# EAGLE board SCCB1508-00 (EAGLE 7.3.0), part 1 of 2
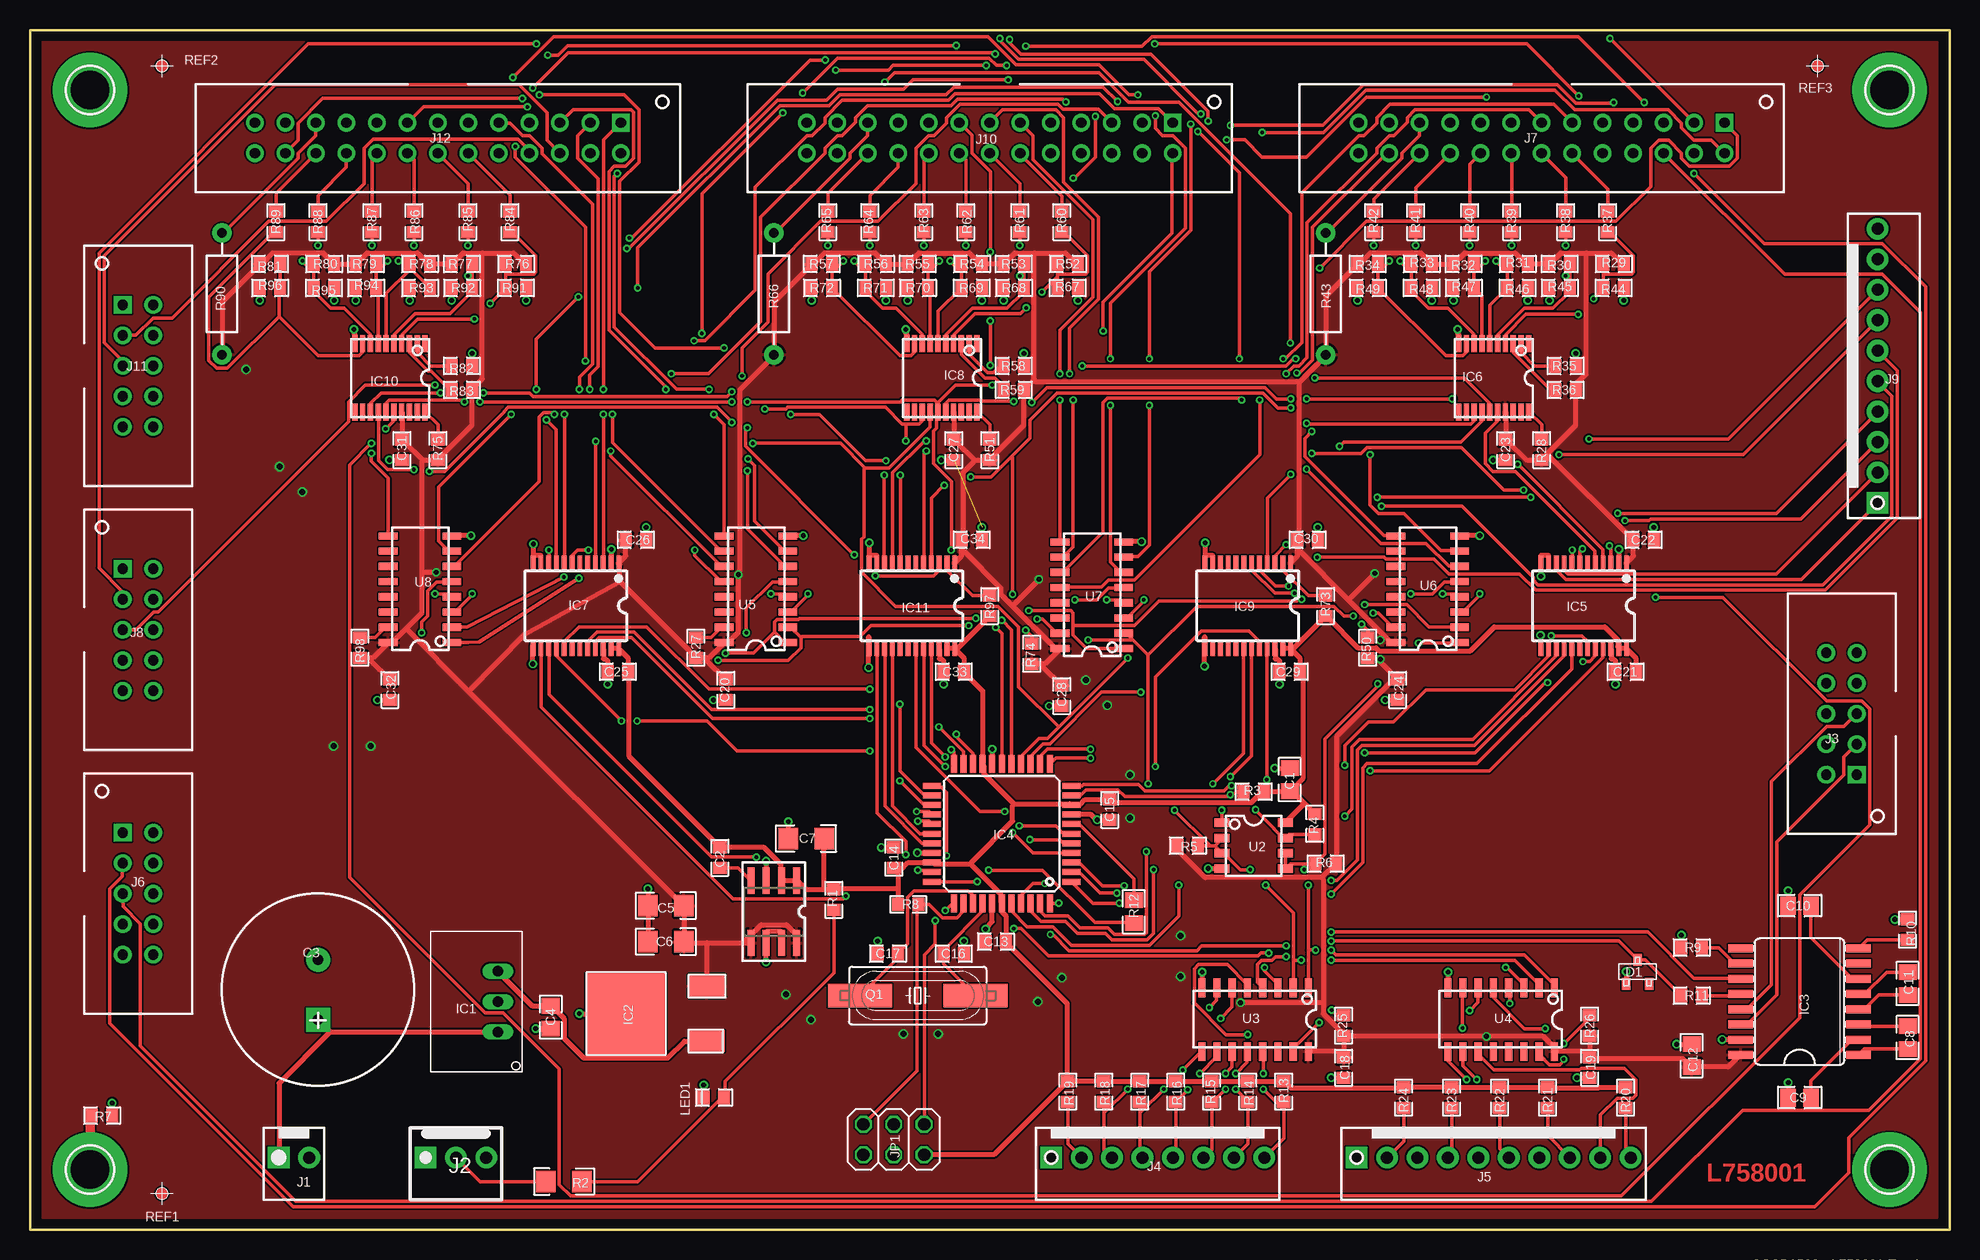
[diagram p2: board, top side]
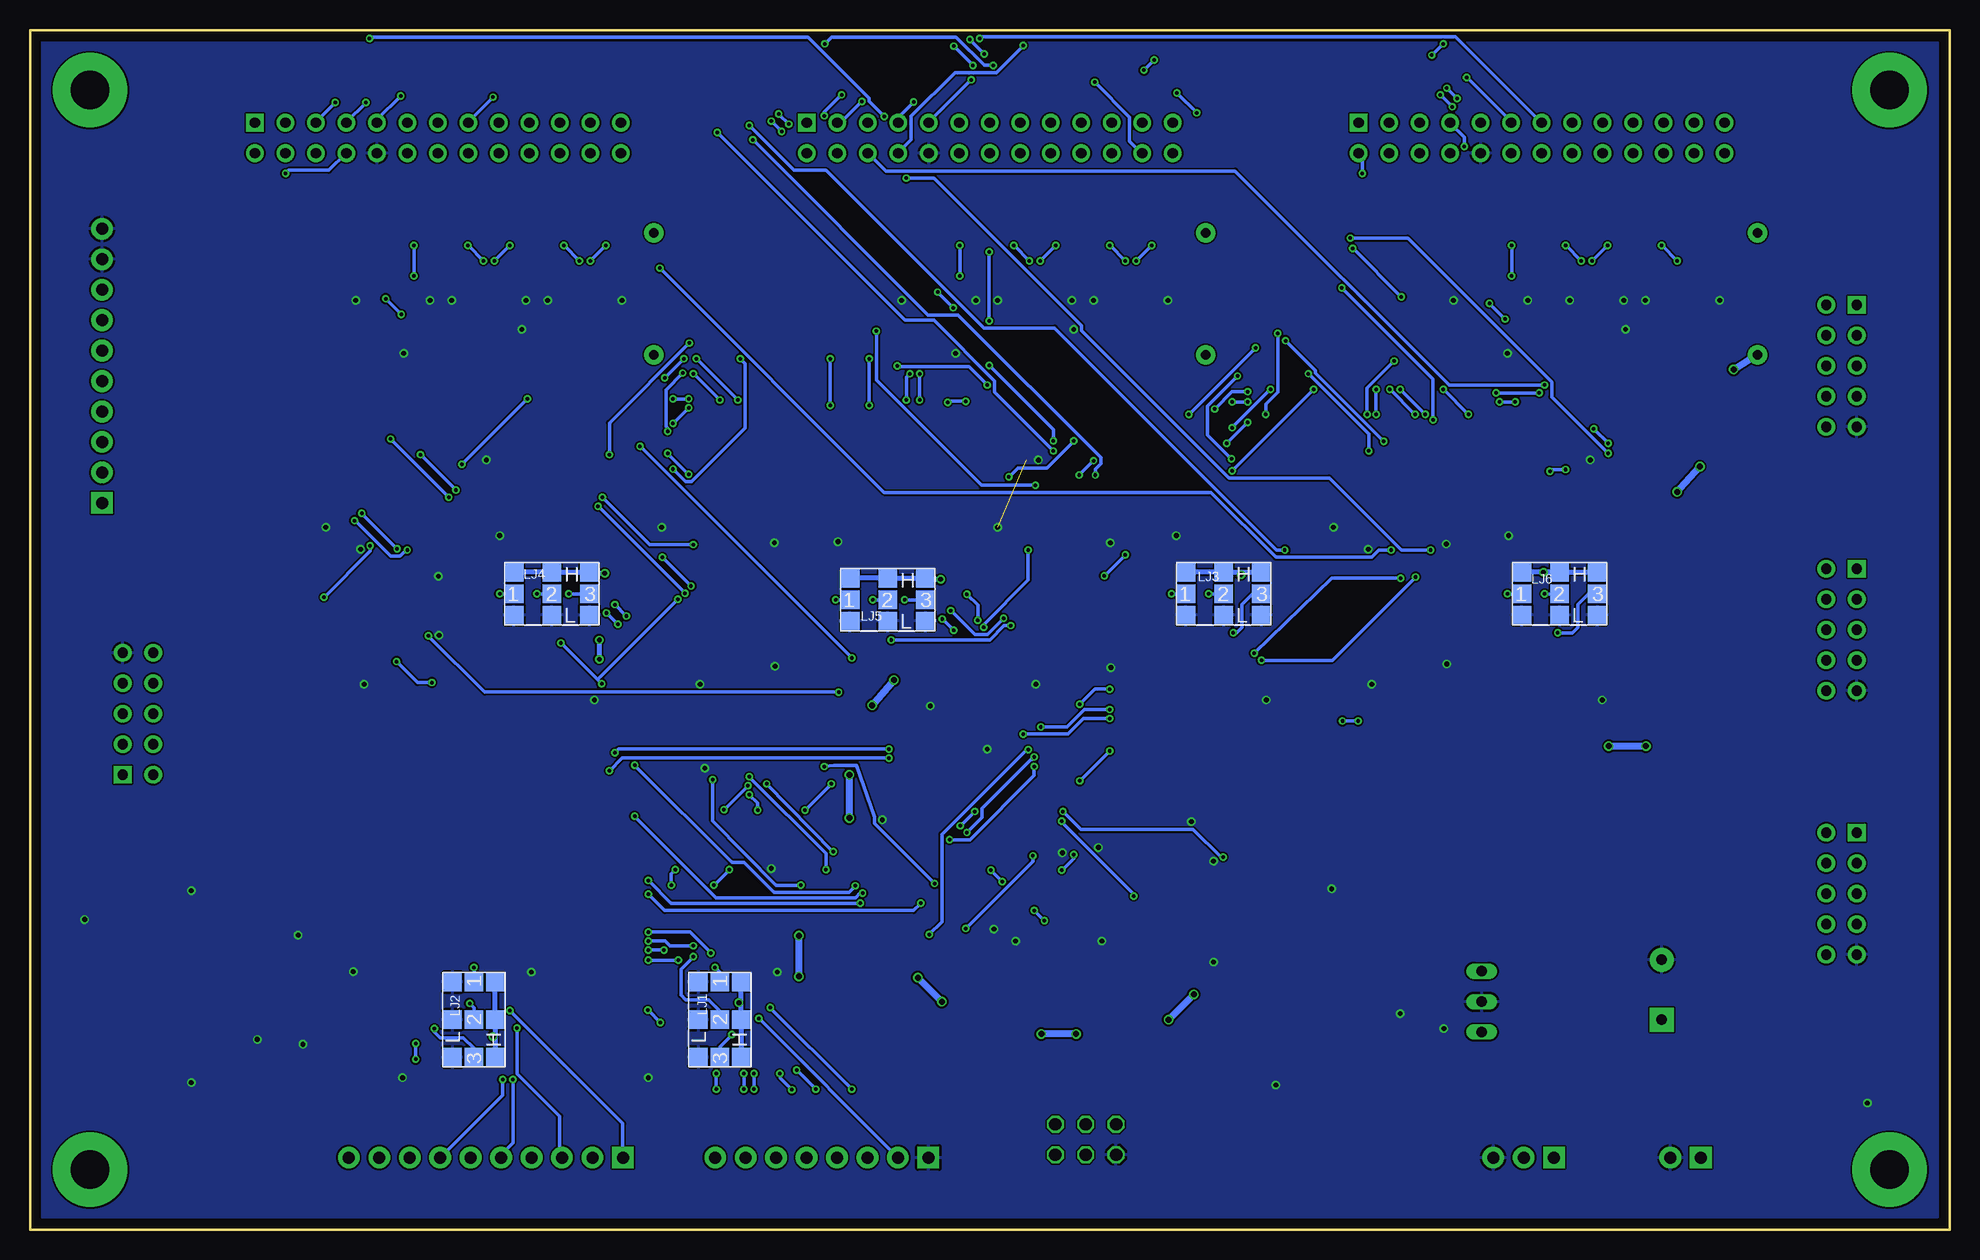
[diagram p3: board, bottom side, seen from below]

Size 160 x 100 mm. Coordinates in mm from the lower left corner, seen from the top.
Outline: 0,0 160,0 160,100 0,100 0,0
Copper layers (1*16): Top 0.035mm / dielectric 1.5mm / Bottom 0.035mm
Design rules "PCB-POOL Standard *": minimum track width 0.3mm, minimum drill 0.3mm, track to track 0.15mm, track to pad 0.15mm, pad to pad 0.15mm, via to via 0.15mm, smd to smd 0.15mm, copper to edge 0.3mm, drill to drill 0.2mm, minimum pad ring 0.2mm, minimum via ring 0.15mm, stop-mask expansion 0.075mm, vias tented up to drill 0mil, thermal gap 0.2mm
Net classes: 1 SUPPLY: width 0.4 mm, drill 0.4 mm

## Footprints (pad centres in the part's own frame; a part is rotated, then mirrored left to right if it is on the bottom)
0805 = smd 1.3 x 1.5: 1 -0.95,0; 2 0.95,0
0603 = smd 1 x 1.1: 1 -0.85,0; 2 0.85,0
C_POL_RM5_D16 = drill 0.86 pad 2 square: 1 -2.5,0 | drill 0.86 pad 2: 2 2.5,0
1206 = smd 1.6 x 1.8: 1 -1.5,0; 2 1.5,0
SOT_23 = smd 0.7 x 1: 1 -0.95,-1; 2 0.95,-1; 3 0,1
TRACO_TSR_1 = drill 0.9 long: P$1 -2.54,0; P$2 0,0; P$3 2.54,0
D_PAK = smd 1.8 x 3: 1 -2.3,-3.4; 3 2.3,-3.4 | smd 6.7 x 6.7: 2 0,3.35
SO16L = smd 0.66 x 2.032: 1 -4.445,-4.902; 2 -3.175,-4.902; 3 -1.905,-4.902; 4 -0.635,-4.902; 5 0.635,-4.902; 6 1.905,-4.902; 7 3.175,-4.902; 8 4.445,-4.902; 9 4.445,4.902; 10 3.175,4.902; 11 1.905,4.902; 12 0.635,4.902; 13 -0.635,4.902; 14 -1.905,4.902; 15 -3.175,4.902; 16 -4.445,4.902
TQFP44 = smd 1.5 x 0.5: 1 -5.8,4; 2 -5.8,3.2; 3 -5.8,2.4; 4 -5.8,1.6; 5 -5.8,0.8; 6 -5.8,0; 7 -5.8,-0.8; 8 -5.8,-1.6; 9 -5.8,-2.4; 10 -5.8,-3.2; 11 -5.8,-4; 23 5.8,-4; 24 5.8,-3.2; 25 5.8,-2.4; 26 5.8,-1.6; 27 5.8,-0.8; 28 5.8,0; 29 5.8,0.8; 30 5.8,1.6; 31 5.8,2.4; 32 5.8,3.2; 33 5.8,4 | smd 0.5 x 1.5: 12 -4,-5.8; 13 -3.2,-5.8; 14 -2.4,-5.8; 15 -1.6,-5.8; 16 -0.8,-5.8; 17 0,-5.8; 18 0.8,-5.8; 19 1.6,-5.8; 20 2.4,-5.8; 21 3.2,-5.8; 22 4,-5.8; 34 4,5.8; 35 3.2,5.8; 36 2.4,5.8; 37 1.6,5.8; 38 0.8,5.8; 39 0,5.8; 40 -0.8,5.8; 41 -1.6,5.8; 42 -2.4,5.8; 43 -3.2,5.8; 44 -4,5.8
SO_24_BW5.3MM = smd 0.4 x 1.2: 1 -3.575,-3.575; 2 -2.925,-3.575; 3 -2.275,-3.575; 4 -1.625,-3.575; 5 -0.975,-3.575; 6 -0.325,-3.575; 7 0.325,-3.575; 8 0.975,-3.575; 9 1.625,-3.575; 10 2.275,-3.575; 11 2.925,-3.575; 12 3.575,-3.575; 13 3.575,3.575; 14 2.925,3.575; 15 2.275,3.575; 16 1.625,3.575; 17 0.975,3.575; 18 0.325,3.575; 19 -0.325,3.575; 20 -0.975,3.575; 21 -1.625,3.575; 22 -2.275,3.575; 23 -2.925,3.575; 24 -3.575,3.575
SSOP_20_BW4.4 = smd 0.45 x 1.4: 1 -2.925,-2.85; 2 -2.275,-2.85; 3 -1.625,-2.85; 4 -0.975,-2.85; 5 -0.325,-2.85; 6 0.325,-2.85; 7 0.975,-2.85; 8 1.625,-2.85; 9 2.275,-2.85; 10 2.925,-2.85; 11 2.925,2.85; 12 2.275,2.85; 13 1.625,2.85; 14 0.975,2.85; 15 0.325,2.85; 16 -0.325,2.85; 17 -0.975,2.85; 18 -1.625,2.85; 19 -2.275,2.85; 20 -2.925,2.85
MOLEX_KK_02POL = drill 1 pad 1.8 square: P$1 -1.27,0 | drill 1 pad 1.8: P$2 1.27,0
MOLEX_KK_03POL = drill 1 pad 1.8 square: P$1 -2.54,0 | drill 1 pad 1.8: P$2 0,0; P$3 2.54,0
IDC_WANNE_10POL = drill 0.864 pad 1.473 square: 1 -5.08,-1.27 | drill 0.864 pad 1.473: 2 -5.08,1.27; 3 -2.54,-1.27; 4 -2.54,1.27; 5 0,-1.27; 6 0,1.27; 7 2.54,-1.27; 8 2.54,1.27; 9 5.08,-1.27; 10 5.08,1.27
MOLEX_KK_08POL = drill 1 pad 1.8 square: P$1 -8.89,0 | drill 1 pad 1.8: P$2 -6.35,0; P$3 -3.81,0; P$4 -1.27,0; P$5 1.27,0; P$6 3.81,0; P$7 6.35,0; P$8 8.89,0
MOLEX_KK_10POL = drill 1 pad 1.8 square: P$1 -11.43,0 | drill 1 pad 1.8: P$2 -8.89,0; P$3 -6.35,0; P$4 -3.81,0; P$5 -1.27,0; P$6 1.27,0; P$7 3.81,0; P$8 6.35,0; P$9 8.89,0; P$10 11.43,0
IDC_WANNE_26POL = drill 0.864 pad 1.473 square: 1 -15.24,-1.27 | drill 0.864 pad 1.473: 2 -15.24,1.27; 3 -12.7,-1.27; 4 -12.7,1.27; 5 -10.16,-1.27; 6 -10.16,1.27; 7 -7.62,-1.27; 8 -7.62,1.27; 9 -5.08,-1.27; 10 -5.08,1.27; 11 -2.54,-1.27; 12 -2.54,1.27; 13 0,-1.27; 14 0,1.27; 15 2.54,-1.27; 16 2.54,1.27; 17 5.08,-1.27; 18 5.08,1.27; 19 7.62,-1.27; 20 7.62,1.27; 21 10.16,-1.27; 22 10.16,1.27; 23 12.7,-1.27; 24 12.7,1.27; 25 15.24,-1.27; 26 15.24,1.27
2X03 = drill 1.016 octagon: 1 -2.54,-1.27; 2 -2.54,1.27; 3 0,-1.27; 4 0,1.27; 5 2.54,-1.27; 6 2.54,1.27
0603_POL = smd 1 x 1.1: 1 -0.85,0; 2 0.85,0
LOETJUMPER_3KHL = smd 1.524 x 1.524: 1 -3.134,0; 2 0,0; 3 3.134,0; H1 -3.134,1.778; H2 0,1.778; H3 3.134,1.778; L1 -3.134,-1.778; L2 0,-1.778; L3 3.134,-1.778
HC49UP = smd 5.334 x 1.93: 1 -4.826,0; 2 4.826,0
RM10L10B2.5 = drill 0.8 pad 1.6: 1 -5.08,0; 2 5.08,0
SOIC127P-6-8POL = smd 0.6 x 2.2: 1 -1.905,-2.6; 2 -0.635,-2.6; 3 0.635,-2.6; 4 1.905,-2.6; 5 1.905,2.6; 6 0.635,2.6; 7 -0.635,2.6; 8 -1.905,2.6
SO_8_BW3.9MM = smd 0.711 x 1.27: 1 -1.905,-2.65; 2 -0.635,-2.65; 3 0.635,-2.65; 4 1.905,-2.65; 5 1.905,2.65; 6 0.635,2.65; 7 -0.635,2.65; 8 -1.905,2.65
SO_16_BW3.9MM = smd 0.6 x 1.55: 1 -5.065,-2.65; 2 -3.795,-2.65; 3 -2.525,-2.65; 4 -1.255,-2.65; 5 0.015,-2.65; 6 1.285,-2.65; 7 2.555,-2.65; 8 3.825,-2.65; 9 3.825,2.65; 10 2.555,2.65; 11 1.285,2.65; 12 0.015,2.65; 13 -1.255,2.65; 14 -2.525,2.65; 15 -3.795,2.65; 16 -5.065,2.65

## Placement (x,y rotation side)
C1  1uF  [0805]  105,37.5 90 top
C2  10nF  [0603]  57.5,31 90 top
C3  470uF/35V  [C_POL_RM5_D16]  24,20 90 top
C4  1uF  [0805]  43.4,17.7 90 top
C5  10uF  [1206]  53,27 0 top
C6  10uF  [1206]  53,24 0 top
C7  10uF  [1206]  64.7,32.6 0 top
C8  1uF  [0805]  156.5,16 90 top
C9  1uF  [0805]  147.5,11 180 top
C10  1uF  [0805]  147.5,27 180 top
C11  1uF  [0805]  156.5,20.5 90 top
C12  1uF  [0805]  138.5,14.5 270 top
C13  100nF  [0603]  80.5,24 0 top
C14  100nF  [0603]  72,31 270 top
C15  100nF  [0603]  90,35 90 top
C16  22pF  [0603]  77,23 180 top
C17  22pF  [0603]  71.5,23 0 top
C18  100nF  [0603]  109.5,13.5 90 top
C19  100nF  [0603]  130,13.5 90 top
C20  100nF  [0603]  58,45 90 top
C21  100nF  [0603]  133,46.5 180 top
C22  100nF  [0603]  134.5,57.5 180 top
C23  100nF  [0603]  123,65 90 top
C24  100nF  [0603]  114,45 90 top
C25  100nF  [0603]  49,46.5 180 top
C26  100nF  [0603]  50.5,57.5 180 top
C27  100nF  [0603]  77,65 90 top
C28  100nF  [0603]  86,44.5 90 top
C29  100nF  [0603]  105,46.5 180 top
C30  100nF  [0603]  106.5,57.5 180 top
C31  100nF  [0603]  31,65 90 top
C32  100nF  [0603]  30,45 90 top
C33  100nF  [0603]  77,46.5 180 top
C34  100nF  [0603]  78.5,57.5 180 top
D1  3V3  [SOT_23]  134,21.5 0 top
IC1  TSR 1-2465  [TRACO_TSR_1]  39,19 90 top
IC2  L4941BDT  [D_PAK]  53,18 90 top
IC3  MAX232ECWE  [SO16L]  147.5,19 90 top
IC4  XMEGA128A4U-AU  [TQFP44]  81,33 180 top
IC5  74LVC4245A  [SO_24_BW5.3MM]  129.5,52 180 top
IC6  IC-MD  [SSOP_20_BW4.4]  122,71 180 top
IC7  74LVC4245A  [SO_24_BW5.3MM]  45.5,52 180 top
IC8  IC-MD  [SSOP_20_BW4.4]  76,71 180 top
IC9  74LVC4245A  [SO_24_BW5.3MM]  101.5,52 180 top
IC10  IC-MD  [SSOP_20_BW4.4]  30,71 180 top
IC11  74LVC4245A  [SO_24_BW5.3MM]  73.5,52 180 top
J1  MOLEX KK  [MOLEX_KK_02POL]  22,6 0 top
J2  MOLEX KK  [MOLEX_KK_03POL]  35.5,6 0 top
J3  IDC Header  [IDC_WANNE_10POL]  151,43 90 top
J4  MOLEX KK  [MOLEX_KK_08POL]  94,6 0 top
J5  MOLEx KK  [MOLEX_KK_10POL]  122,6 0 top
J6  IDC Header  [IDC_WANNE_10POL]  9,28 270 top
J7  IDC Header  [IDC_WANNE_26POL]  126,91 180 top
J8  IDC Header  [IDC_WANNE_10POL]  9,50 270 top
J9  MOLEX KK  [MOLEX_KK_10POL]  154,72 90 top
J10  IDC Header  [IDC_WANNE_26POL]  80,91 180 top
J11  IDC Header  [IDC_WANNE_10POL]  9,72 270 top
J12  IDC Header  [IDC_WANNE_26POL]  34,91 180 top
JP1  PIN HEADER  [2X03]  72,7.5 180 top
LED1  green  [0603_POL]  57,11 0 top
LJ1  [LOETJUMPER_3KHL]  102.5,17.5 270 bottom
LJ2  [LOETJUMPER_3KHL]  123,17.5 270 bottom
LJ3  [LOETJUMPER_3KHL]  60.5,53 0 bottom
LJ4  [LOETJUMPER_3KHL]  116.5,53 0 bottom
LJ5  [LOETJUMPER_3KHL]  88.5,52.5 0 bottom
LJ6  [LOETJUMPER_3KHL]  32.5,53 0 bottom
Q1  14.74560 MHz  [HC49UP]  74,19.5 180 top
R1  1K  [0603]  67,27.5 90 top
R2  na  [1206]  44.5,4 180 top
R3  1K  [0603]  102,36.5 180 top
R4  1K  [0603]  107.1,33.8 270 top
R5  2K2  [0603]  96.5,32 0 top
R6  2K2  [0603]  108,30.5 180 top
R7  na  [0603]  6,9.5 0 top
R8  10K  [0603]  73.2,27.1 0 top
R9  10K  [0603]  138.5,23.5 0 top
R10  10K  [0603]  156.5,25 270 top
R11  1K  [0603]  138.5,19.5 0 top
R12  na  [0805]  92,26.5 270 top
R13  10K  [0603]  104.5,11.5 270 top
R14  10K  [0603]  101.5,11.5 270 top
R15  10K  [0603]  98.5,11.5 270 top
R16  10K  [0603]  95.5,11.5 270 top
R17  10K  [0603]  92.5,11.5 270 top
R18  10K  [0603]  89.5,11.5 270 top
R19  10K  [0603]  86.5,11.5 270 top
R20  10K  [0603]  133,11 270 top
R21  10K  [0603]  126.5,11 270 top
R22  10K  [0603]  122.5,11 270 top
R23  10K  [0603]  118.5,11 270 top
R24  10K  [0603]  114.5,11 270 top
R25  10K  [0603]  109.5,17 270 top
R26  10K  [0603]  130,17 270 top
R27  10K  [0603]  55.5,48.5 270 top
R28  10K  [0603]  126,65 90 top
R29  1K  [0603]  132,80.5 0 top
R30  1K  [0603]  127.5,80.5 180 top
R31  1K  [0603]  124,80.5 0 top
R32  1K  [0603]  119.5,80.5 180 top
R33  1K  [0603]  116,80.5 0 top
R34  1K  [0603]  111.5,80.5 180 top
R35  4K7  [0603]  128,72 180 top
R36  4K7  [0603]  128,70 180 top
R37  4K7  [0603]  131.5,84 90 top
R38  4K7  [0603]  128,84 90 top
R39  4K7  [0603]  123.5,84 90 top
R40  4K7  [0603]  120,84 90 top
R41  4K7  [0603]  115.5,84 90 top
R42  4K7  [0603]  112,84 90 top
R43  na  [RM10L10B2.5]  108,78 90 top
R44  1K  [0603]  132,78.5 180 top
R45  1K  [0603]  127.5,78.5 0 top
R46  1K  [0603]  124,78.5 180 top
R47  1K  [0603]  119.5,78.5 0 top
R48  1K  [0603]  116,78.5 180 top
R49  1K  [0603]  111.5,78.5 0 top
R50  10K  [0603]  111.5,48.5 270 top
R51  10K  [0603]  80,65 90 top
R52  1K  [0603]  86.5,80.5 0 top
R53  1K  [0603]  82,80.5 180 top
R54  1K  [0603]  78.5,80.5 0 top
R55  1K  [0603]  74,80.5 180 top
R56  1K  [0603]  70.5,80.5 0 top
R57  1K  [0603]  66,80.5 180 top
R58  4K7  [0603]  82,72 180 top
R59  4K7  [0603]  82,70 180 top
R60  4K7  [0603]  86,84 90 top
R61  4K7  [0603]  82.5,84 90 top
R62  4K7  [0603]  78,84 90 top
R63  4K7  [0603]  74.5,84 90 top
R64  4K7  [0603]  70,84 90 top
R65  4K7  [0603]  66.5,84 90 top
R66  na  [RM10L10B2.5]  62,78 90 top
R67  1K  [0603]  86.5,78.5 180 top
R68  1K  [0603]  82,78.5 0 top
R69  1K  [0603]  78.5,78.5 180 top
R70  1K  [0603]  74,78.5 0 top
R71  1K  [0603]  70.5,78.5 180 top
R72  1K  [0603]  66,78.5 0 top
R73  10K  [0603]  108,52 90 top
R74  10K  [0603]  83.5,48 270 top
R75  10K  [0603]  34,65 90 top
R76  1K  [0603]  40.5,80.5 0 top
R77  1K  [0603]  36,80.5 180 top
R78  1K  [0603]  32.5,80.5 0 top
R79  1K  [0603]  28,80.5 180 top
R80  1K  [0603]  24.5,80.5 0 top
R81  1K  [0603]  20,80.5 180 top
R82  4K7  [0603]  36,72 180 top
R83  4K7  [0603]  36,70 180 top
R84  4K7  [0603]  40,84 90 top
R85  4K7  [0603]  36.5,84 90 top
R86  4K7  [0603]  32,84 90 top
R87  4K7  [0603]  28.5,84 90 top
R88  4K7  [0603]  24,84 90 top
R89  4K7  [0603]  20.5,84 90 top
R90  na  [RM10L10B2.5]  16,78 90 top
R91  1K  [0603]  40.5,78.5 180 top
R92  1K  [0603]  36,78.5 0 top
R93  1K  [0603]  32.5,78.5 0 top
R94  1K  [0603]  28,78.5 0 top
R95  1K  [0603]  24.5,78.5 180 top
R96  1K  [0603]  20,78.5 0 top
R97  10K  [0603]  80,52 90 top
R98  10K  [0603]  27.5,48.5 270 top
REF1  PASSERMARKE_1.0  [PASSERMARKE_01]  11,3 90 top
REF2  PASSERMARKE_1.0  [PASSERMARKE_01]  11,97 90 top
REF3  PASSERMARKE_1.0  [PASSERMARKE_01]  149,97 90 top
U1  LT1763-3.3  [SOIC127P-6-8POL]  62,26.5 180 top
U2  P82B96  [SO_8_BW3.9MM]  102,32 270 top
U3  PCA9557  [SO_16_BW3.9MM]  101.5,17.5 180 top
U4  PCA9557  [SO_16_BW3.9MM]  122,17.5 180 top
U5  PCA9557  [SO_16_BW3.9MM]  60.5,54 90 top
U6  PCA9557  [SO_16_BW3.9MM]  116.5,54 90 top
U7  PCA9557  [SO_16_BW3.9MM]  88.5,53.5 90 top
U8  PCA9557  [SO_16_BW3.9MM]  32.5,54 90 top